# Altium project extern_v1.2.PrjPcb
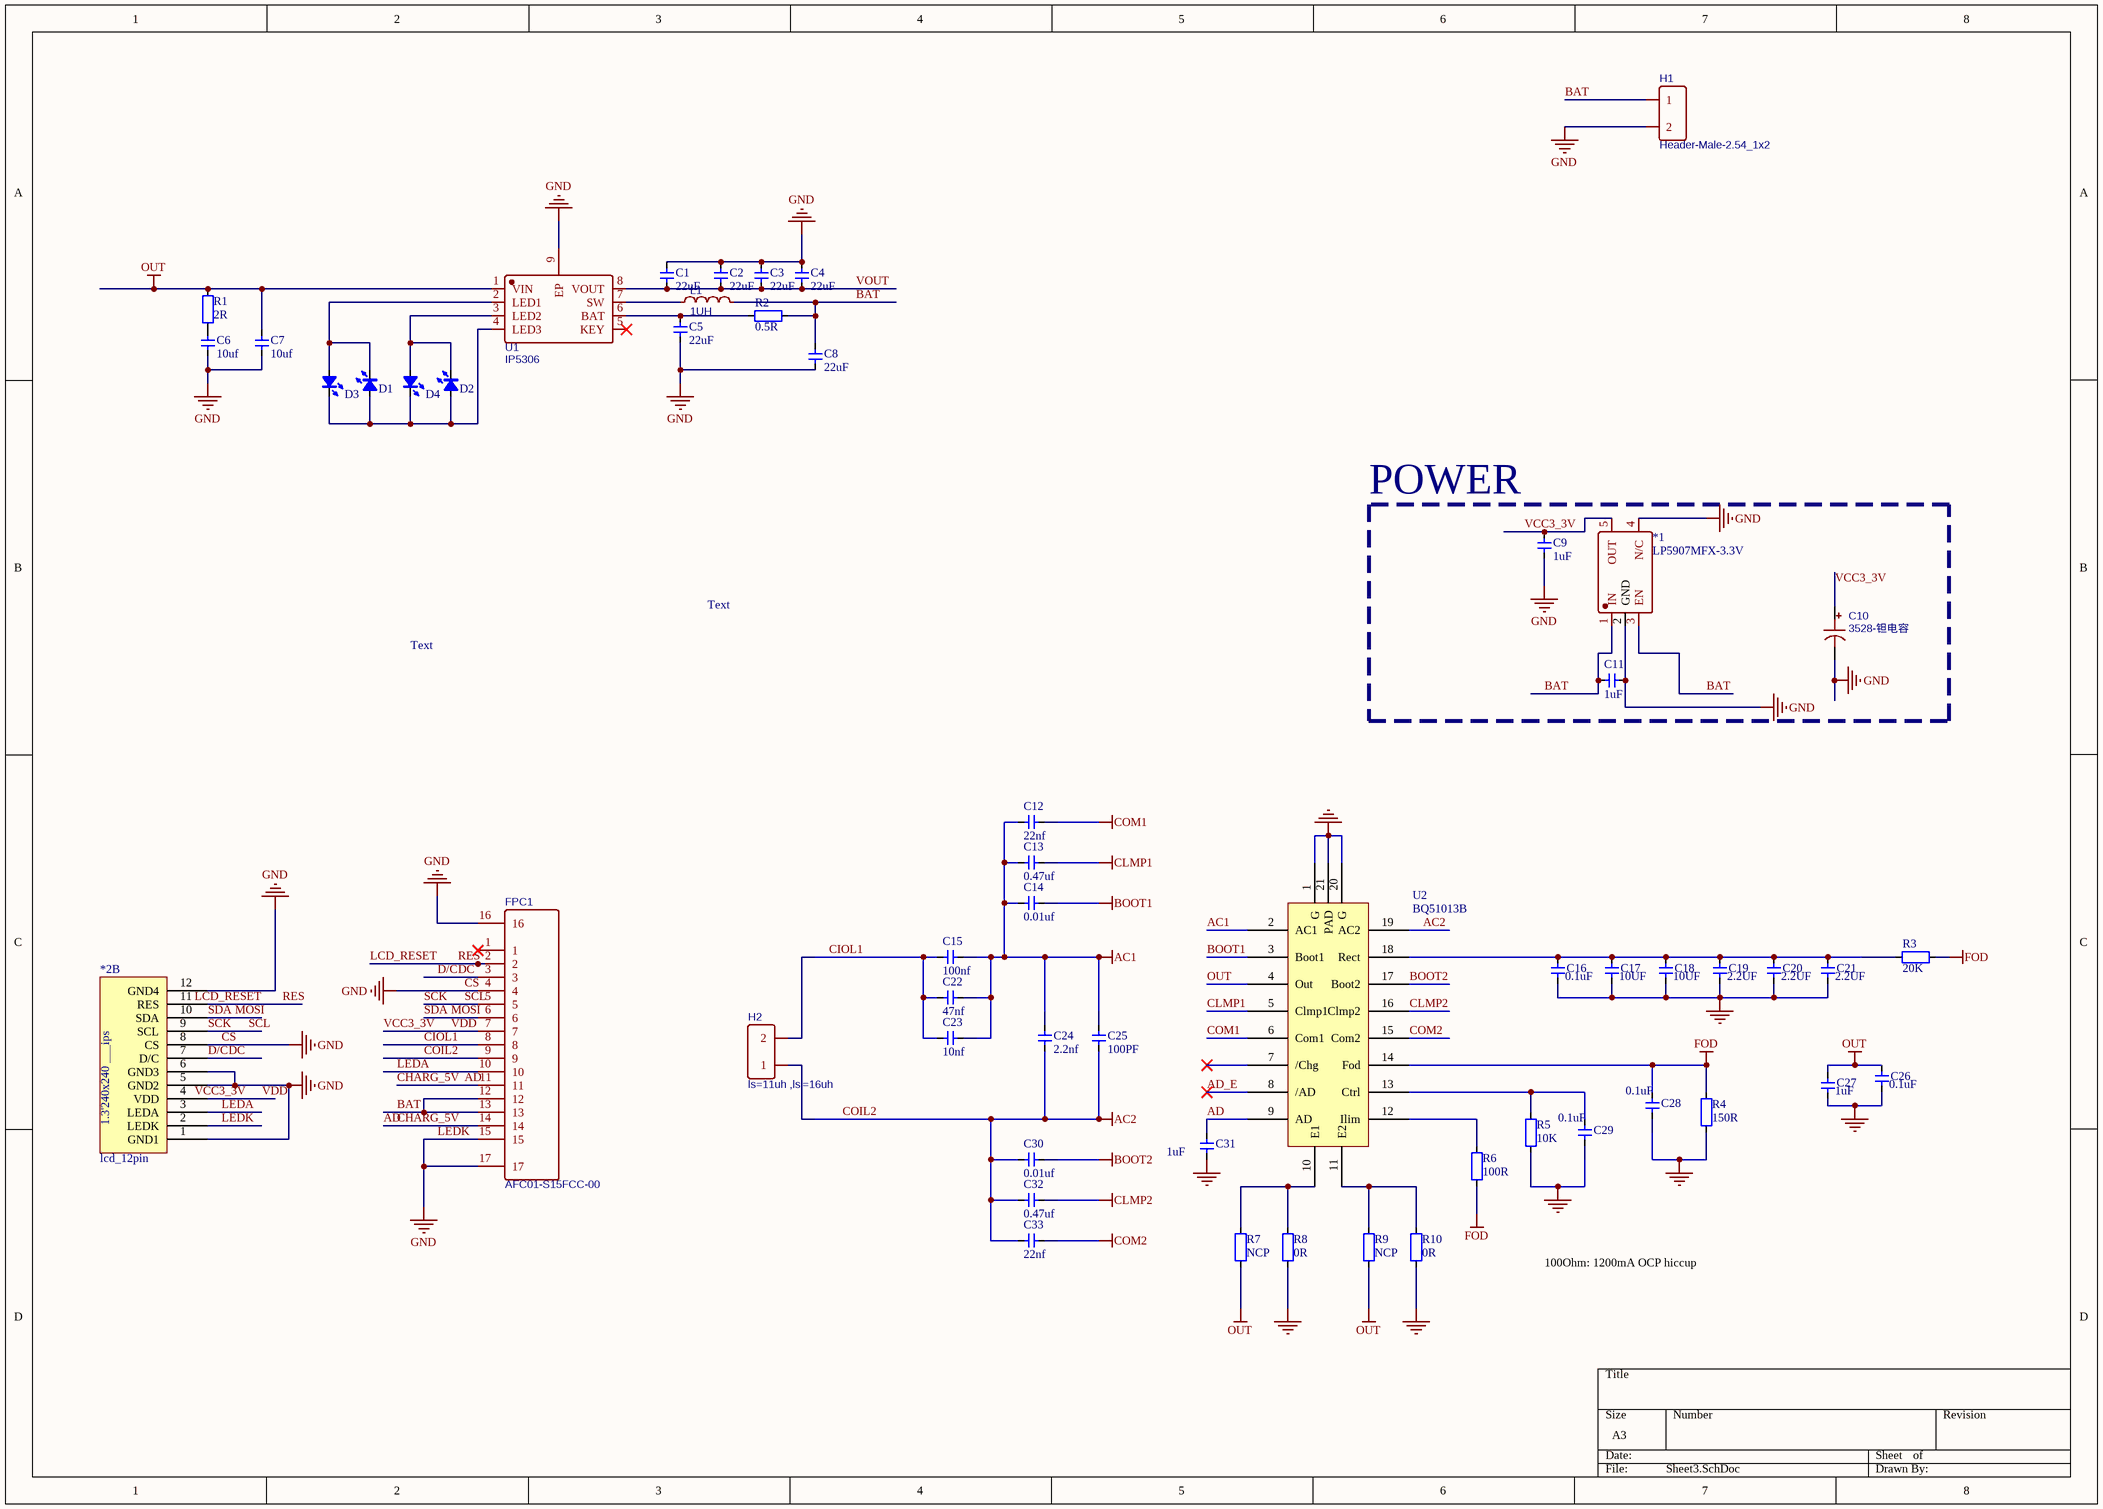
[diagram p0: Sheet3.SchDoc]
1 sheet, 55 parts. Net scope: global (net labels, ports and power ports of the same name join across sheets).
Board file: PCB4.PcbDoc

## Sheet Sheet3.SchDoc
size A3

### Parts
*1  LP5907MFX-3.3V  [LP5907MFX-3.3V]
*2  lcd_12pin  [1.3‘240x240__ips]  (part B of 2)
C1  22uF  [CAP_0402]
C2  22uF  [CAP_0402]
C3  22uF  [CAP_0402]
C4  22uF  [CAP_0402]
C5  22uF  [CAP_0402]
C6  10uf  [CAP_0402]
C7  10uf  [CAP_0402]
C8  22uF  [CAP_0402]
C9  1uF  [CAP_0402]
C10  3528-钽电容  [CAP-SMD_L3.5-W2.8]
C11  1uF  [CAP_0402]
C12  22nf  [CAP_0402]
C13  0.47uf  [CAP_0402]
C14  0.01uf  [CAP_0402]
C15  100nf  [CAP_0402]
C16  0.1uF  [CAP_0402]
C17  10UF  [CAP_0402]
C18  10UF  [CAP_0402]
C19  2.2UF  [CAP_0402]
C20  2.2UF  [CAP_0402]
C21  2.2UF  [CAP_0402]
C22  47nf  [CAP_0402]
C23  10nf  [CAP_0402]
C24  2.2nf  [CAP_0402]
C25  100PF  [CAP_0402]
C26  0.1uF  [CAP_0402]
C27  1uF  [CAP_0402]
C28  0.1uF  [CAP_0402]
C29  0.1uF  [CAP_0402]
C30  0.01uf  [CAP_0402]
C31  1uF  [CAP_0402]
C32  0.47uf  [CAP_0402]
C33  22nf  [CAP_0402]
D1  color?  [LED_0402_GREEN]  (value not drawn)
D2  color?  [LED_0402_GREEN]  (value not drawn)
D3  color?  [LED_0402_GREEN]  (value not drawn)
D4  color?  [LED_0402_GREEN]  (value not drawn)
FPC1  AFC01-S15FCC-00  [FPC-SMD_AFC01-S15FCC-00]
H1  Header-Male-2.54_1x2  [HDR-TH_2P-P2.54-V]
H2  ls=11uh ,ls'=16uh  [HDR-TH_2P-P2.54-V]
L1  1UH  [IND-SMD_L4.2-W4.2_MS0420-XX]
R1  2R  [RES_0402]
R2  0.5R  [R0603]
R3  20K  [RES_0402]
R4  150R  [RES_0402]
R5  10K  [RES_0402]
R6  100R  [RES_0402]
R7  NCP  [RES_0402]
R8  0R  [RES_0402]
R9  NCP  [RES_0402]
R10  0R  [RES_0402]
U1  IP5306  [ESOP-8_L4.9-W3.9-P1.27-LS6.0-BL-EP]
U2  BQ51013B  [IC_MSP430FR2522IRHLR]

### Blocks framed on the sheet
POWER: *1 C9-C11

### Nets
AC1: C12.1 C13.1 C14.1 C15.2 C22.2 C23.2 C24.2 C25.2 U2.2(AC1)
AC2: C24.1 C25.1 C30.1 C32.1 C33.1 FPC1.9 H2.1 U2.19(AC2)  [also labelled COIL2]
BOOT1: C14.2 U2.3(Boot1)
BOOT2: C30.2 U2.17(Boot2)
CLMP1: C13.2 U2.5(Clmp1)
CLMP2: C32.2 U2.16(Clmp2)
COM1: C12.2 U2.6(Com1)
COM2: C33.2 U2.15(Com2)
CS: *1.2(GND) *1.4(N/C) *2.1(GND1) *2.2(LEDK) *2.5(GND2) *2.6(GND3) *2.8(CS) *2.12(GND4) C1.1 C2.1 C3.1 C4.1 C5.2 C6.1 C7.1 C8.2 C9.2 C10.2 C11.1 C16.2 C17.2 C18.2 C19.2 C20.2 C21.2 C26.2 C27.2 C28.2 C29.2 C31.2 FPC1.4 FPC1.15 FPC1.16 FPC1.17 H1.2 R4.2 R5.2 R8.2 R10.2 U1.9(EP) U2.1(G) U2.20(G) U2.21(PAD)  [also labelled GND, LEDK]
FOD: C28.1 R3.2 R4.1 R6.2 U2.14(Fod)
OUT: C7.2 C26.1 C27.1 R1.1 R7.2 R9.2 U1.1(VIN) U2.4(Out)
AD: C31.1 FPC1.11 FPC1.14 U2.9(AD)  [also labelled CHARG_5V]
AD_E: U2.8(/AD)
BAT: *1.1(IN) *1.3(EN) C8.1 C11.2 FPC1.12 FPC1.13 H1.1 L1.2 R2.1
CIOL1: C15.1 C22.1 C23.1 FPC1.8 H2.2
D/C: *2.7(D/C) FPC1.3  [also labelled DC]
LCD_RESET: *2.11(RES) FPC1.2  [also labelled RES]
LEDA: *2.3(LEDA) FPC1.10
MOSI: *2.10(SDA) FPC1.6  [also labelled SDA]
SCK: *2.9(SCL) FPC1.5  [also labelled SCL]
VCC3_3V: *1.5(OUT) *2.4(VDD) C9.1 C10.1 FPC1.7  [also labelled VDD]
VOUT: C1.2 C2.2 C3.2 C4.2 U1.8(VOUT)
NetC5_1: C5.1 R2.2 U1.6(BAT)
NetC6_2: C6.2 R1.2
NetC16_1: C16.1 C17.1 C18.1 C19.1 C20.1 C21.1 R3.1 U2.18(Rect)
NetC29_1: C29.1 R5.1 U2.13(Ctrl)
NetD1_1: D1.1(A) D2.1(A) D3.2(K) D4.2(K) U1.4(LED3)
NetD1_2: D1.2(K) D3.1(A) U1.2(LED1)
NetD2_2: D2.2(K) D4.1(A) U1.3(LED2)
NetL1_1: L1.1 U1.7(SW)
NetR6_1: R6.1 U2.12(Ilim)
NetR7_1: R7.1 R8.1 U2.10(E1)
NetR9_1: R9.1 R10.1 U2.11(E2)

Not connected (* = marked no-connect by the designer): FPC1 1*; U1 5(KEY)*; U2 7(/Chg)*

### Notes on the sheet
- Text
- 100Ohm: 1200mA OCP hiccup
- Labels drawn without touching a wire or pin: LCD_RESET, VCC3_3V
- (in symbol lcd_12pin, part B) 1.3'240x240 ___ips

### Library data of the parts
C1-C9 C11-C33 = 电容-0402: Capacitor; Value: 0.1u
C10 = 3528-钽电容: BOM_Manufacturer: Hunan Xiangyee in S&T; BOM_Manufacturer Part: CA45-B016M476T; nameAlias: Capacitance; Contributor: LCSC; BOM_Supplier: LCSC; BOM_Supplier Part: C435294; BOM_JLCPCB Part Class: Extended Part; spicePre: C; spiceSymbolName: CA45-B016M476T
D1-D4 = LED灯_0402: LED; Type: 0402; Value: color?
FPC1 = FPC-15P-0.5-AFC01-S15FCC-00: BOM_Manufacturer: JUSHUO; Contributor: LCSC; BOM_Supplier: LCSC; BOM_Supplier Part: C262271; BOM_Manufacturer Part: AFC01-S15FCC-00; BOM_JLCPCB Part Class: Extended Part; spicePre: F; spiceSymbolName: AFC01-S15FCC-00
H1 H2 = 排针-1*2: BOM_Manufacturer: TE Connectivity; BOM_Manufacturer Part: 826629-2; BOM_Supplier: LCSC; BOM_Supplier Part: C86471; BOM_JLCPCB Part Class: Extended Part; spicePre: H; spiceSymbolName: Header-Male-2.54_1x2
L1 = 电感-0420: BOM_Manufacturer: COILMX; BOM_Manufacturer Part: MS0420-100M; nameAlias: Inductance; Contributor: LCSC; BOM_Supplier: LCSC; BOM_Supplier Part: C380158; BOM_JLCPCB Part Class: Extended Part; spicePre: L; spiceSymbolName: MS0420-100M
R1 R3-R10 = 电阻-0402: Resistor; Value: 22R
R2 = 电阻-0603: Resistor; Value: 22R
U1 = IP5306: 充电宝芯片_支持边充边放; BOM_Manufacturer: INJOINIC; Contributor: LCSC; BOM_Supplier: LCSC; BOM_Supplier Part: C181692; BOM_Manufacturer Part: IP5306; BOM_JLCPCB Part Class: Extended Part; spicePre: U; spiceSymbolName: IP5306
U2 = BQ51013B: 无线充电接受，qi